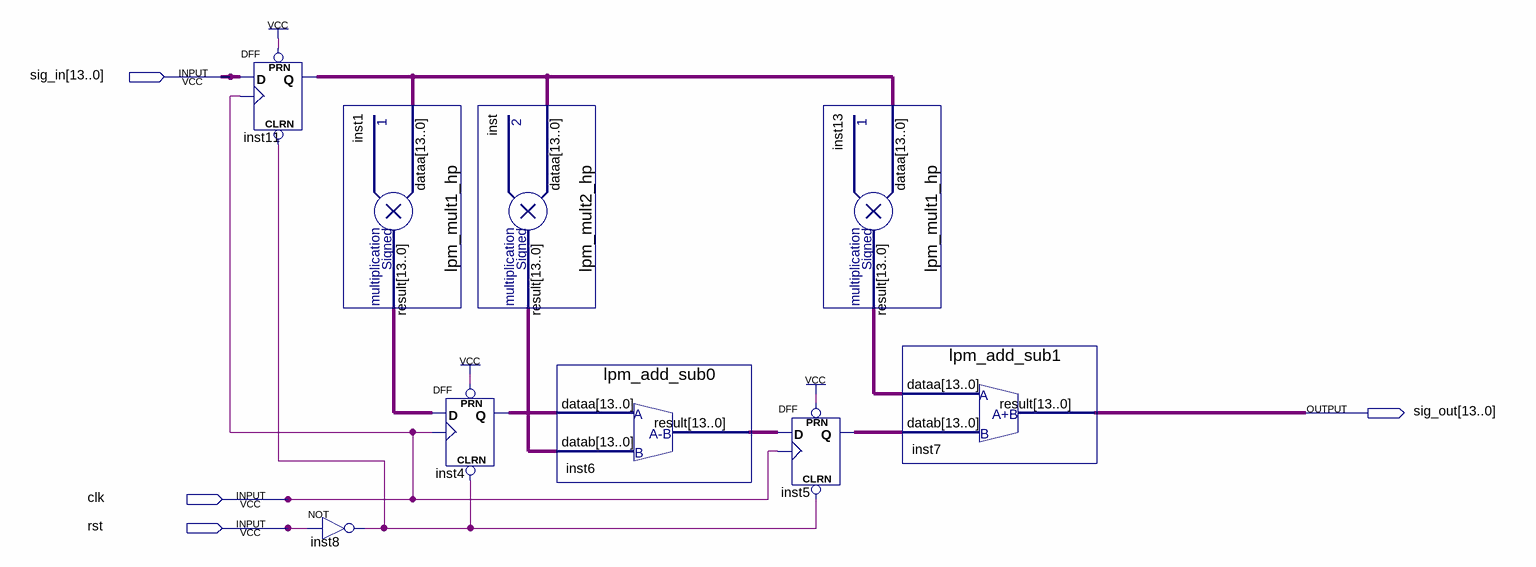
[diagram p0: schematic sheet]
// Quartus schematic high_pass_transposed_graph.bdf as structural Verilog: 9 symbols, 4 pins
module high_pass_transposed_graph (
  input  [13:0] sig_in,
  input  clk,
  input  rst,
  output [13:0] sig_out
);

  wire inst8_out;
  wire [13:0] inst1_result, inst4_q, inst5_q, inst6_result, inst11_q, inst13_result, inst_result;

  DFF inst11[13:0] (.CLRN(inst8_out), .CLK(clk), .D(sig_in), .PRN(1'b1), .Q(inst11_q));
  not inst8 (inst8_out, rst);
  lpm_mult1_hp inst1 (.dataa(inst11_q), .result(inst1_result));
  lpm_mult2_hp inst (.dataa(inst11_q), .result(inst_result));
  DFF inst4[13:0] (.CLRN(inst8_out), .CLK(clk), .D(inst1_result), .PRN(1'b1), .Q(inst4_q));
  lpm_add_sub0 inst6 (.dataa(inst4_q), .datab(inst_result), .result(inst6_result));
  DFF inst5[13:0] (.CLRN(inst8_out), .CLK(clk), .D(inst6_result), .PRN(1'b1), .Q(inst5_q));
  lpm_mult1_hp inst13 (.dataa(inst11_q), .result(inst13_result));
  lpm_add_sub1 inst7 (.dataa(inst13_result), .datab(inst5_q), .result(sig_out));
endmodule
